# Altium schematic sheet P23_MIPI CSI1_MIPI CSI2.SchDoc
size 420 x 297 mm
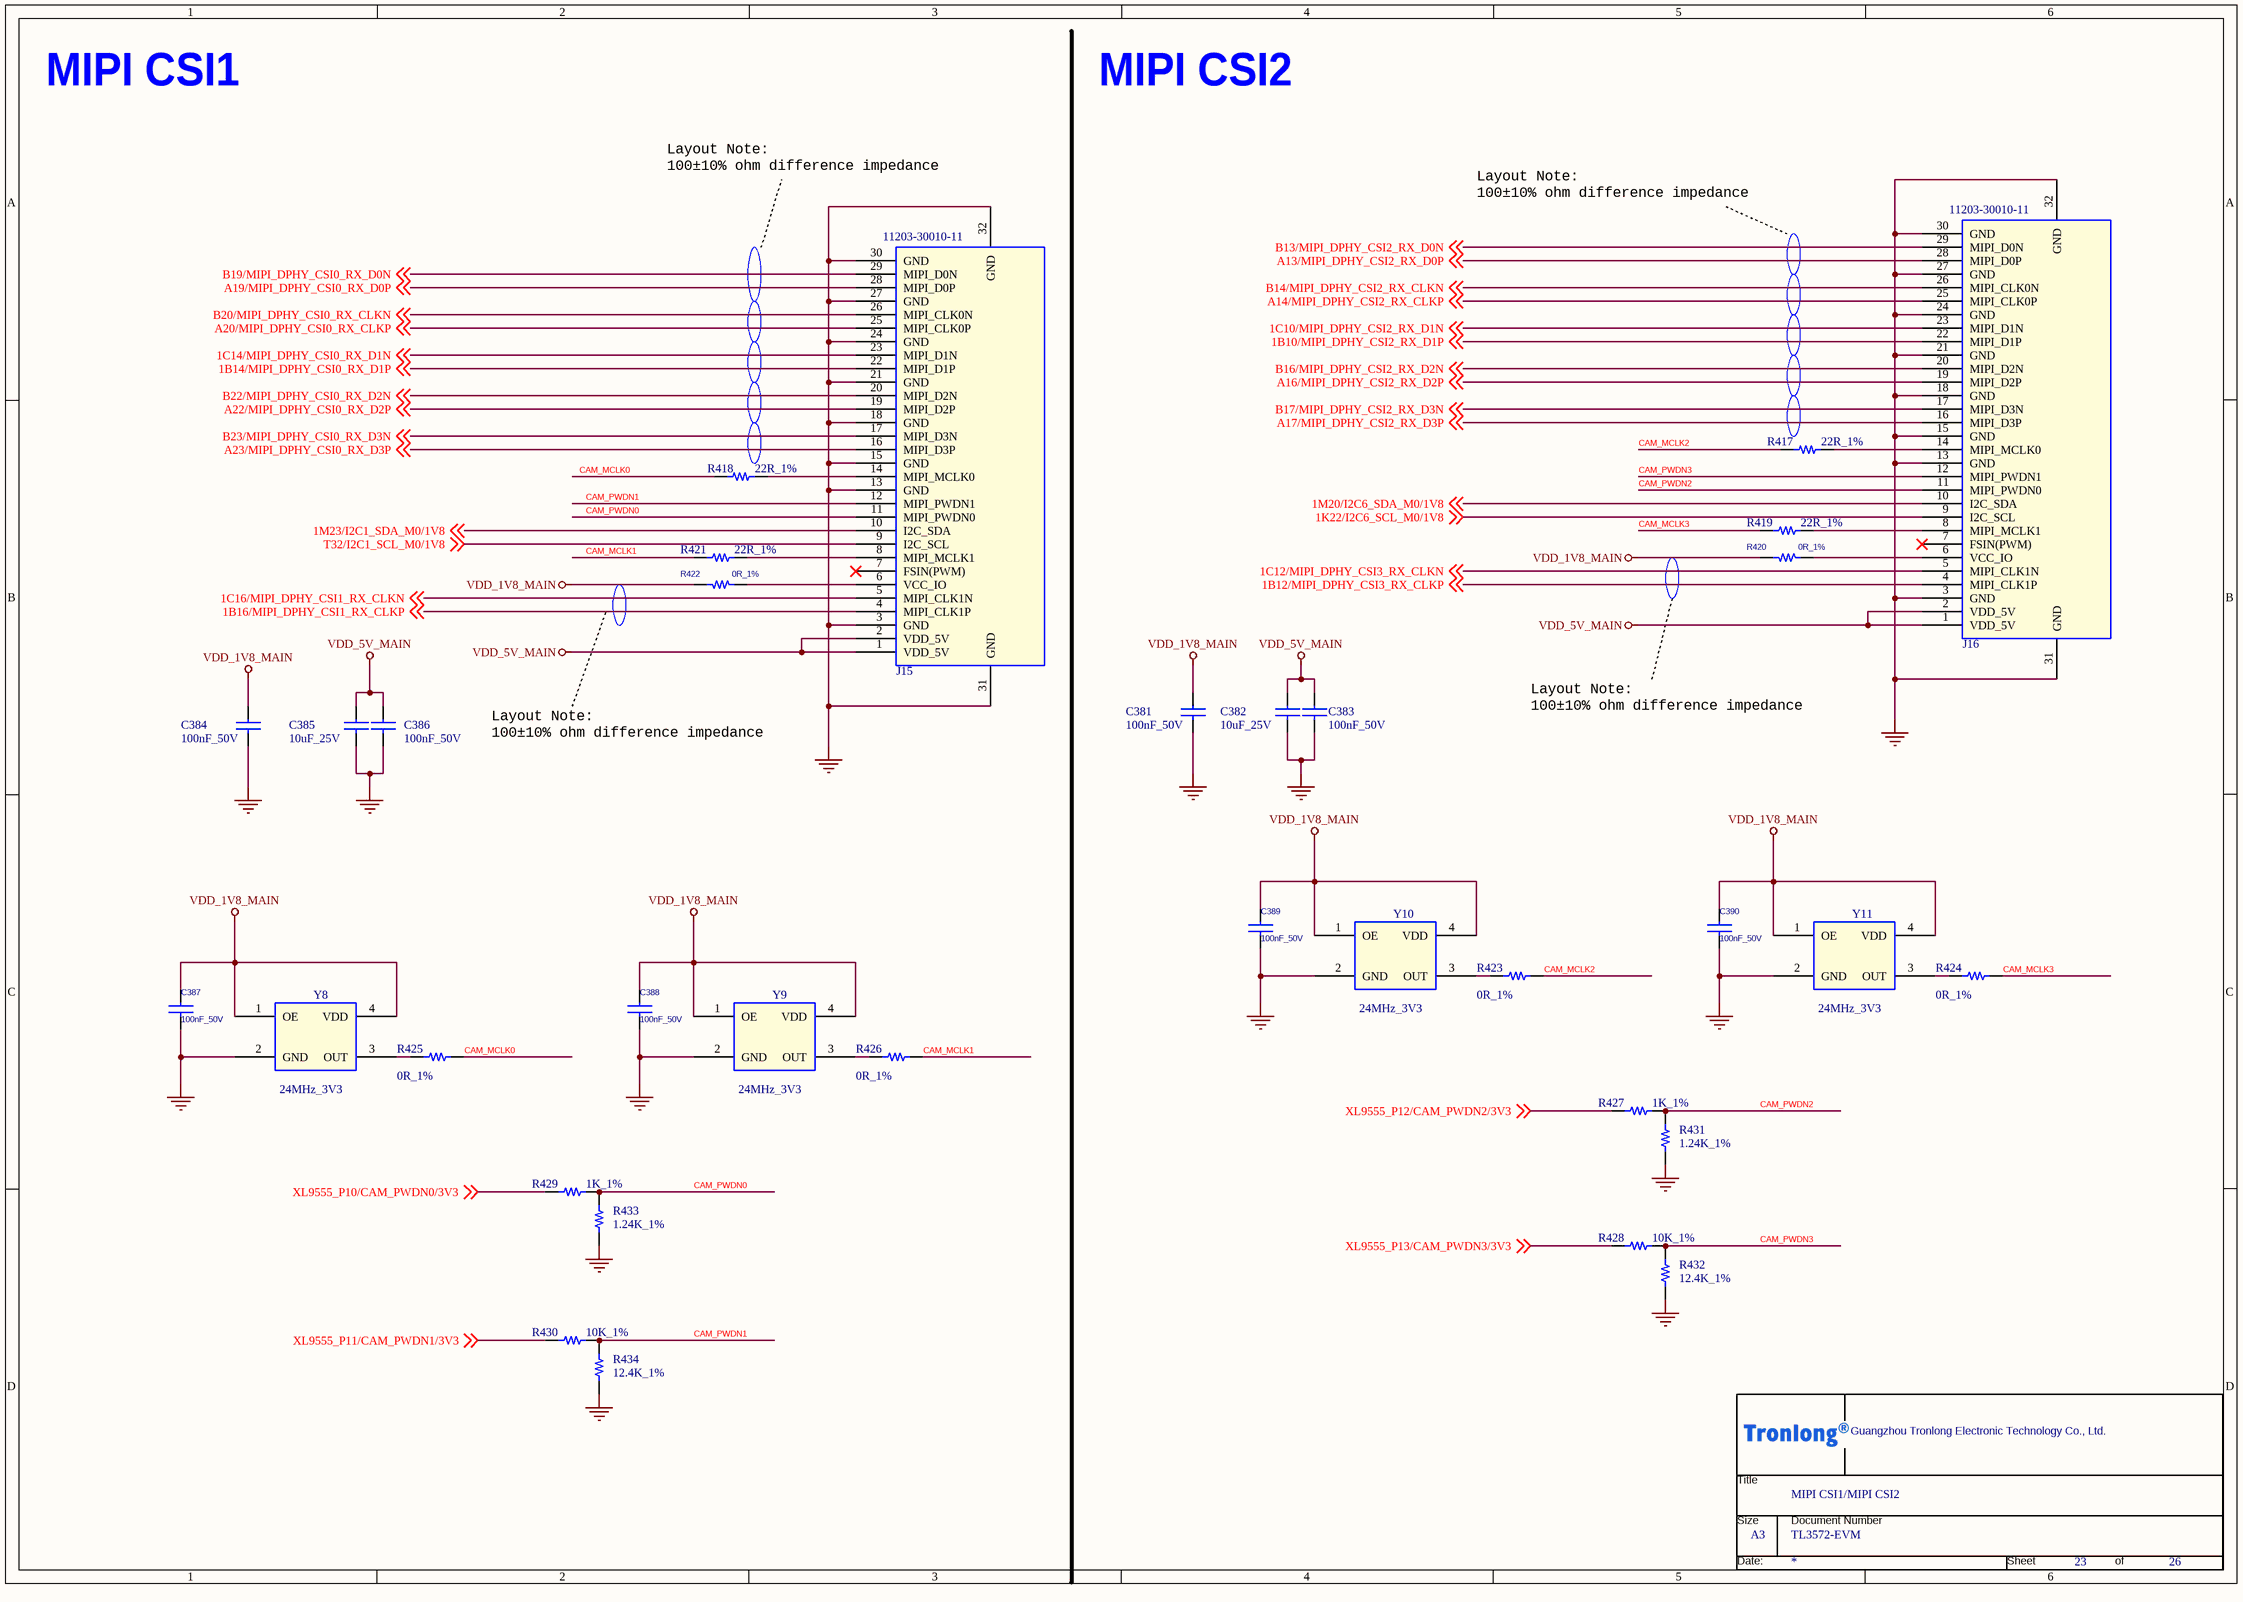
[diagram p0: P23_MIPI CSI1_MIPI CSI2.SchDoc]

## Parts
*  Page Count: 26  Page Number: 23  Page Size: A3  OrgName: Guangzhou Tronlong Electronic Technology Co., Ltd.  Title: MIPI CSI1/MIPI CSI2  Doc: TL3572-EVM  (hidden comment: TL_NEW)  (graphical)
C381  100nF_50V  [C0402]
C382  10uF_25V  [C0603]
C383  100nF_50V  [C0402]
C384  100nF_50V  [C0402]
C385  10uF_25V  [C0603]
C386  100nF_50V  [C0402]
C387  100nF_50V  [C0402]
C388  100nF_50V  [C0402]
C389  100nF_50V  [C0402]
C390  100nF_50V  [C0402]
J15  11203-30010-11  [CON_FFC_0D5_30P]
J16  11203-30010-11  [CON_FFC_0D5_30P]
R417  22R_1%  [R0402]
R418  22R_1%  [R0402]
R419  22R_1%  [R0402]
R420  0R_1%  [R0402]
R421  22R_1%  [R0402]
R422  0R_1%  [R0402]
R423  0R_1%  [R0603]
R424  0R_1%  [R0603]
R425  0R_1%  [R0603]
R426  0R_1%  [R0603]
R427  1K_1%  [R0402]
R428  10K_1%  [R0402]
R429  1K_1%  [R0402]
R430  10K_1%  [R0402]
R431  1.24K_1%  [R0402]
R432  12.4K_1%  [R0402]
R433  1.24K_1%  [R0402]
R434  12.4K_1%  [R0402]
Y8  24MHz_3V3  [SMD_3225]
Y9  24MHz_3V3  [SMD_3225]
Y10  24MHz_3V3  [SMD_3225]
Y11  24MHz_3V3  [SMD_3225]

## Nets
GND: C381.2 C382.2 C383.2 C384.2 C385.2 C386.2 C387.2 C388.2 C389.2 C390.2 J15.3(GND) J15.13(GND) J15.15(GND) J15.18(GND) J15.21(GND) J15.24(GND) J15.27(GND) J15.30(GND) J15.31(GND) J15.32(GND) J16.3(GND) J16.13(GND) J16.15(GND) J16.18(GND) J16.21(GND) J16.24(GND) J16.27(GND) J16.30(GND) J16.31(GND) J16.32(GND) R431.1 R432.1 R433.1 R434.1 Y8.2(GND) Y9.2(GND) Y10.2(GND) Y11.2(GND)
VDD_1V8_MAIN: C381.1 C384.1 C387.1 C388.1 C389.1 C390.1 R420.2 R422.2 Y8.1(OE) Y8.4(VDD) Y9.1(OE) Y9.4(VDD) Y10.1(OE) Y10.4(VDD) Y11.1(OE) Y11.4(VDD)
VDD_5V_MAIN: C382.1 C383.1 C385.1 C386.1 J15.1(VDD_5V) J15.2(VDD_5V) J16.1(VDD_5V) J16.2(VDD_5V)
1B10/MIPI_DPHY_CSI2_RX_D1P: J16.22(MIPI_D1P) ; off-sheet 1B10/MIPI_DPHY_CSI2_RX_D1P
1B12/MIPI_DPHY_CSI3_RX_CLKP: J16.4(MIPI_CLK1P) ; off-sheet 1B12/MIPI_DPHY_CSI3_RX_CLKP
1B14/MIPI_DPHY_CSI0_RX_D1P: J15.22(MIPI_D1P) ; off-sheet 1B14/MIPI_DPHY_CSI0_RX_D1P
1B16/MIPI_DPHY_CSI1_RX_CLKP: J15.4(MIPI_CLK1P) ; off-sheet 1B16/MIPI_DPHY_CSI1_RX_CLKP
1C10/MIPI_DPHY_CSI2_RX_D1N: J16.23(MIPI_D1N) ; off-sheet 1C10/MIPI_DPHY_CSI2_RX_D1N
1C12/MIPI_DPHY_CSI3_RX_CLKN: J16.5(MIPI_CLK1N) ; off-sheet 1C12/MIPI_DPHY_CSI3_RX_CLKN
1C14/MIPI_DPHY_CSI0_RX_D1N: J15.23(MIPI_D1N) ; off-sheet 1C14/MIPI_DPHY_CSI0_RX_D1N
1C16/MIPI_DPHY_CSI1_RX_CLKN: J15.5(MIPI_CLK1N) ; off-sheet 1C16/MIPI_DPHY_CSI1_RX_CLKN
1K22/I2C6_SCL_M0/1V8: J16.9(I2C_SCL) ; off-sheet 1K22/I2C6_SCL_M0/1V8
1M20/I2C6_SDA_M0/1V8: J16.10(I2C_SDA) ; off-sheet 1M20/I2C6_SDA_M0/1V8
1M23/I2C1_SDA_M0/1V8: J15.10(I2C_SDA) ; off-sheet 1M23/I2C1_SDA_M0/1V8
A13/MIPI_DPHY_CSI2_RX_D0P: J16.28(MIPI_D0P) ; off-sheet A13/MIPI_DPHY_CSI2_RX_D0P
A14/MIPI_DPHY_CSI2_RX_CLKP: J16.25(MIPI_CLK0P) ; off-sheet A14/MIPI_DPHY_CSI2_RX_CLKP
A16/MIPI_DPHY_CSI2_RX_D2P: J16.19(MIPI_D2P) ; off-sheet A16/MIPI_DPHY_CSI2_RX_D2P
A17/MIPI_DPHY_CSI2_RX_D3P: J16.16(MIPI_D3P) ; off-sheet A17/MIPI_DPHY_CSI2_RX_D3P
A19/MIPI_DPHY_CSI0_RX_D0P: J15.28(MIPI_D0P) ; off-sheet A19/MIPI_DPHY_CSI0_RX_D0P
A20/MIPI_DPHY_CSI0_RX_CLKP: J15.25(MIPI_CLK0P) ; off-sheet A20/MIPI_DPHY_CSI0_RX_CLKP
A22/MIPI_DPHY_CSI0_RX_D2P: J15.19(MIPI_D2P) ; off-sheet A22/MIPI_DPHY_CSI0_RX_D2P
A23/MIPI_DPHY_CSI0_RX_D3P: J15.16(MIPI_D3P) ; off-sheet A23/MIPI_DPHY_CSI0_RX_D3P
B13/MIPI_DPHY_CSI2_RX_D0N: J16.29(MIPI_D0N) ; off-sheet B13/MIPI_DPHY_CSI2_RX_D0N
B14/MIPI_DPHY_CSI2_RX_CLKN: J16.26(MIPI_CLK0N) ; off-sheet B14/MIPI_DPHY_CSI2_RX_CLKN
B16/MIPI_DPHY_CSI2_RX_D2N: J16.20(MIPI_D2N) ; off-sheet B16/MIPI_DPHY_CSI2_RX_D2N
B17/MIPI_DPHY_CSI2_RX_D3N: J16.17(MIPI_D3N) ; off-sheet B17/MIPI_DPHY_CSI2_RX_D3N
B19/MIPI_DPHY_CSI0_RX_D0N: J15.29(MIPI_D0N) ; off-sheet B19/MIPI_DPHY_CSI0_RX_D0N
B20/MIPI_DPHY_CSI0_RX_CLKN: J15.26(MIPI_CLK0N) ; off-sheet B20/MIPI_DPHY_CSI0_RX_CLKN
B22/MIPI_DPHY_CSI0_RX_D2N: J15.20(MIPI_D2N) ; off-sheet B22/MIPI_DPHY_CSI0_RX_D2N
B23/MIPI_DPHY_CSI0_RX_D3N: J15.17(MIPI_D3N) ; off-sheet B23/MIPI_DPHY_CSI0_RX_D3N
CAM_MCLK0: R418.1 R425.2
CAM_MCLK1: R421.1 R426.2
CAM_MCLK2: R417.1 R423.2
CAM_MCLK3: R419.1 R424.2
CAM_PWDN0: J15.11(MIPI_PWDN0) R429.1 R433.2
CAM_PWDN1: J15.12(MIPI_PWDN1) R430.1 R434.2
CAM_PWDN2: J16.11(MIPI_PWDN0) R427.1 R431.2
CAM_PWDN3: J16.12(MIPI_PWDN1) R428.1 R432.2
T32/I2C1_SCL_M0/1V8: J15.9(I2C_SCL) ; off-sheet T32/I2C1_SCL_M0/1V8
XL9555_P10/CAM_PWDN0/3V3: R429.2 ; off-sheet XL9555_P10/CAM_PWDN0/3V3
XL9555_P11/CAM_PWDN1/3V3: R430.2 ; off-sheet XL9555_P11/CAM_PWDN1/3V3
XL9555_P12/CAM_PWDN2/3V3: R427.2 ; off-sheet XL9555_P12/CAM_PWDN2/3V3
XL9555_P13/CAM_PWDN3/3V3: R428.2 ; off-sheet XL9555_P13/CAM_PWDN3/3V3
NetJ15_6: J15.6(VCC_IO) R422.1
NetJ15_8: J15.8(MIPI_MCLK1) R421.2
NetJ15_14: J15.14(MIPI_MCLK0) R418.2
NetJ16_6: J16.6(VCC_IO) R420.1
NetJ16_8: J16.8(MIPI_MCLK1) R419.2
NetJ16_14: J16.14(MIPI_MCLK0) R417.2
NetR423_1: R423.1 Y10.3(OUT)
NetR424_1: R424.1 Y11.3(OUT)
NetR425_1: R425.1 Y8.3(OUT)
NetR426_1: R426.1 Y9.3(OUT)

Not connected (* = marked no-connect by the designer): J15 7(FSIN(PWM))*; J16 7(FSIN(PWM))*

## Notes on the sheet
- MIPI CSI1
- MIPI CSI2
- Layout Note:
  100±10% ohm difference impedance
- (in symbol TL_NEW) Title; Size; Document Number; Date:; Sheet; of

## Library data of the parts
* = TL_NEW: RevCode: A?; Page Create Date: March  8, 1995; Page Modify Date: *; Document: TL3572-EVM
C381 C383 C384 C386 = CAP NP_Dup2: 贴片陶瓷电容,100nF,10%,50V,X7R; Manufacturer: 广东风华高新科技股份有限公司（FH）; Manufacturer Character: 中国大陆; Manufacturer PartNumber: 0402B104K500NT; Eco-Label: ROHS; ERP Number: 005.0001.0001.00681; Operation Temperature（℃）: -55~+125(Ta); As-Welded: /; PCB Footprint: C0402; ERP PCB Footprint: C0402; Part Status: 试用
C382 = CAP NP_Dup2: 贴片陶瓷电容,10uF,20%,25V,X5R; Manufacturer: 广东风华高新科技股份有限公司（FH）; Manufacturer Character: 中国大陆; Manufacturer PartNumber: 0603X106M250NT; Eco-Label: ROHS; ERP Number: 005.0001.0001.00527; Operation Temperature（℃）: -55~+85(Ta); As-Welded: /; PCB Footprint: C0603; Part Status: 优选; ERP PCB Footprint: C0603
C385 = CAP NP_Dup2: 贴片陶瓷电容,10uF,20%,25V,X5R; Manufacturer PartNumber: 0603X106M250NT; Manufacturer Character: 中国大陆; Manufacturer: 广东风华高新科技股份有限公司（FH）; As-Welded: /; Operation Temperature（℃）: -55~+85(Ta); ERP Number: 005.0001.0001.00527; Eco-Label: ROHS; PCB Footprint: C0603; ERP PCB Footprint: C0603; Part Status: 优选
C387-C390 = CAP NP_Dup2: 贴片陶瓷电容,100nF,10%,50V,X7R; Manufacturer Character: 中国大陆; Manufacturer PartNumber: 0402B104K500NT; Manufacturer: 广东风华高新科技股份有限公司（FH）; ERP Number: 005.0001.0001.00681; Operation Temperature（℃）: -55~+125(Ta); As-Welded: /; Eco-Label: ROHS; PCB Footprint: C0402; Part Status: 试用
J15 = 30PIN FPC CON_2: FFC座,30P,0.5mm间距,翻盖下接式,H=2.0mm; Manufacturer Character: 中国大陆; Manufacturer: 深圳市联畅精密电子有限公司(LCP); ERP PCB Footprint: CON_FFC_30P_0D5_F_DOWN_SMD; Eco-Label: ROHS; ERP Number: 005.0001.0003.00381; Operation Temperature（℃）: -40~+85(Ta); As-Welded: /; PCB Footprint: CON_FFC_0D5_30P; Manufacturer PartNumber: 11203-30010-11; Part Status: 优选
J16 = 30PIN FPC CON_2: FFC座,30P,0.5mm间距,翻盖下接式,H=2.0mm; Manufacturer Character: 中国大陆; Manufacturer: 深圳市联畅精密电子有限公司(LCP); Eco-Label: ROHS; ERP Number: 005.0001.0003.00381; Operation Temperature（℃）: -40~+85(Ta); As-Welded: /; ERP PCB Footprint: CON_FFC_30P_0D5_F_DOWN_SMD; PCB Footprint: CON_FFC_0D5_30P; Part Status: 优选; Manufacturer PartNumber: 11203-30010-11
R417 R418 = Resistor_Dup3: 贴片电阻,22R,±1%,1/16W; Manufacturer PartNumber: RC-02K22R0FT; Manufacturer Character: 中国大陆; Manufacturer: 广东风华高新科技股份有限公司（FH）; CLASS: DISCRETE; As-Welded: /; Operation Temperature（℃）: -55~+125(Ta); AGILE_PN: 470-75394; Tolerance: 5%; MFG_NAME01: ROHM; MFG_PN01: MCR01MZPJ000; CAD_APPROVED: Yes; FPLIST: RC0402_25,RC0402_HD,RC0402_X2,0402_CC; ERP Number: 005.0001.0002.01316; Eco-Label: ROHS; PCB Footprint: R0402; Part Status: 试用; ROHS: Yes; HEIGHT: 0.45 MM; ERP PCB Footprint: R0402
R419 = Resistor_Dup3: 贴片电阻,22R,±1%,1/16W; Manufacturer PartNumber: RC-02K22R0FT; Manufacturer Character: 中国大陆; Manufacturer: 广东风华高新科技股份有限公司（FH）; CLASS: DISCRETE; As-Welded: /; FPLIST: RC0402_25,RC0402_HD,RC0402_X2,0402_CC; CAD_APPROVED: Yes; MFG_PN01: MCR01MZPJ000; MFG_NAME01: ROHM; Tolerance: 5%; AGILE_PN: 470-75394; Operation Temperature（℃）: -55~+125(Ta); ERP Number: 005.0001.0002.01316; Eco-Label: ROHS; PCB Footprint: R0402; ERP PCB Footprint: R0402; HEIGHT: 0.45 MM; ROHS: Yes; Part Status: 试用
R420 = Resistor_Dup3: 贴片电阻,0R,±1%,1/16W; Manufacturer: 广东风华高新科技股份有限公司（FH）; Manufacturer Character: 中国大陆; Manufacturer PartNumber: RC-02000FT; CLASS: DISCRETE; Eco-Label: ROHS; ERP Number: 005.0001.0002.00938; Operation Temperature（℃）: -55~+155(Ta); As-Welded: /; PCB Footprint: R0402; ERP PCB Footprint: R0402; Part Status: 优选
R421 = Resistor_Dup3: 贴片电阻,22R,±1%,1/16W; Manufacturer: 广东风华高新科技股份有限公司（FH）; Manufacturer Character: 中国大陆; Manufacturer PartNumber: RC-02K22R0FT; CLASS: DISCRETE; Eco-Label: ROHS; ERP Number: 005.0001.0002.01316; Operation Temperature（℃）: -55~+125(Ta); AGILE_PN: 470-75394; Tolerance: 5%; MFG_NAME01: ROHM; MFG_PN01: MCR01MZPJ000; CAD_APPROVED: Yes; FPLIST: RC0402_25,RC0402_HD,RC0402_X2,0402_CC; As-Welded: /; PCB Footprint: R0402; ERP PCB Footprint: R0402; ROHS: Yes; HEIGHT: 0.45 MM; Part Status: 试用
R422 = Resistor_Dup3: 贴片电阻,0R,±1%,1/16W; Manufacturer PartNumber: RC-02000FT; Manufacturer Character: 中国大陆; Manufacturer: 广东风华高新科技股份有限公司（FH）; CLASS: DISCRETE; As-Welded: /; Operation Temperature（℃）: -55~+155(Ta); ERP Number: 005.0001.0002.00938; Eco-Label: ROHS; PCB Footprint: R0402; ERP PCB Footprint: R0402; Part Status: 优选
R423 R425 = Resistor_Dup3: 贴片电阻,0R,±1%,1/10W; Manufacturer: 广东风华高新科技股份有限公司（FH）; Manufacturer PartNumber: RS-03000FT; Manufacturer Character: 中国大陆; CLASS: DISCRETE; Eco-Label: ROHS; As-Welded: /; room: RS232; Operation Temperature（℃）: -55~+155(Ta); ERP Number: 005.0001.0002.00956; PCB Footprint: R0603; Part Status: 优选
R424 R426 = Resistor_Dup3: 贴片电阻,0R,±1%,1/10W; Manufacturer Character: 中国大陆; Manufacturer PartNumber: RS-03000FT; Manufacturer: 广东风华高新科技股份有限公司（FH）; CLASS: DISCRETE; ERP Number: 005.0001.0002.00956; Operation Temperature（℃）: -55~+155(Ta); room: RS232; As-Welded: /; Eco-Label: ROHS; PCB Footprint: R0603; Part Status: 优选
R427 R429 = Resistor_Dup3: 贴片电阻,1K,±1%,1/16W; Manufacturer Character: 中国大陆; Manufacturer PartNumber: RC-02K1001FT; Manufacturer: 广东风华高新科技股份有限公司（FH）; CLASS: DISCRETE; Eco-Label: ROHS; ERP Number: 005.0001.0002.01327; Operation Temperature（℃）: -55~+125(Ta); As-Welded: /; PCB Footprint: R0402; Part Status: 优选; Temperature: –55~155℃; ERP PCB Footprint: R0402
R428 = Resistor_Dup3: 贴片电阻,10K,±1%,1/16W; Manufacturer: 广东风华高新科技股份有限公司（FH）; Manufacturer PartNumber: RC-02K1002FT; Manufacturer Character: 中国大陆; CLASS: DISCRETE; As-Welded: /; Operation Temperature（℃）: -55~+125(Ta); ERP Number: 005.0001.0002.01326; Eco-Label: ROHS; PCB Footprint: R0402; ERP PCB Footprint: R0402; Temperature: –55~155℃; Part Status: 优选
R430 = Resistor_Dup3: 贴片电阻,10K,±1%,1/16W; Manufacturer Character: 中国大陆; Manufacturer PartNumber: RC-02K1002FT; Manufacturer: 广东风华高新科技股份有限公司（FH）; CLASS: DISCRETE; Eco-Label: ROHS; ERP Number: 005.0001.0002.01326; Operation Temperature（℃）: -55~+125(Ta); As-Welded: /; PCB Footprint: R0402; Part Status: 优选; Temperature: –55~155℃; ERP PCB Footprint: R0402
R431 R433 = Resistor_Dup3: 贴片电阻,1.24K,±1%,1/16W; Manufacturer Character: 中国大陆; Manufacturer PartNumber: RC-02K1241FT; Manufacturer: 广东风华高新科技股份有限公司（FH）; CLASS: DISCRETE; As-Welded: /; Operation Temperature（℃）: -55~+155(Ta); ERP Number: 005.0001.0002.01456; Eco-Label: ROHS; PCB Footprint: R0402; ERP PCB Footprint: R0402; Temperature: -55~155℃; Part Status: 测评
R432 R434 = Resistor_Dup3: 0402WGF1242TCE; Manufacturer PartNumber: 12.4K,±1%,R0402,≥1/16W; Manufacturer: 广州创龙; CLASS: DISCRETE; As-Welded: /; Operation Temperature（℃）: -40~+85(Ta); ERP Number: 005.0001.0023.00040; Eco-Label: ROHS; PCB Footprint: R0402; ERP PCB Footprint: R0402; Manufacturer Character: -; Temperature: -55~155℃; Part Status: -
Y8-Y11 = CMX309: 四脚有源晶振,24MHz,1.62V~3.63V,CMOS,±30ppm; Manufacturer Character: 中国大陆; Manufacturer: 深圳市星通时频电子有限公司（SCTF）; Mfr_Part_Number: S3M24.576B20F30TNN; Mfr_Name: Citizen; Manufacturer PartNumber: SX3M24.000M20F30TNN; ERP Number: 005.0001.0005.00121; room: 14; As-Welded: /; Operation Temperature（℃）: -40~+85(Ta); Eco-Label: ROHS; PCB Footprint: SMD_3225; Part Status: 试用; ROHS: Yes; DATASHEET_PATH: M:\OrCad\CIS_database\Logic_Data_Sheets\Crystals_Oscillators\Citizen\CSX_750F.pdf; WEB_LINK: http://LPDSRV18.logicpd.com:8010/Everest_LOGIC/HcmServlet?action=OpenEmailObject&classid=21&objid=6273689; Temperature: -40~85℃